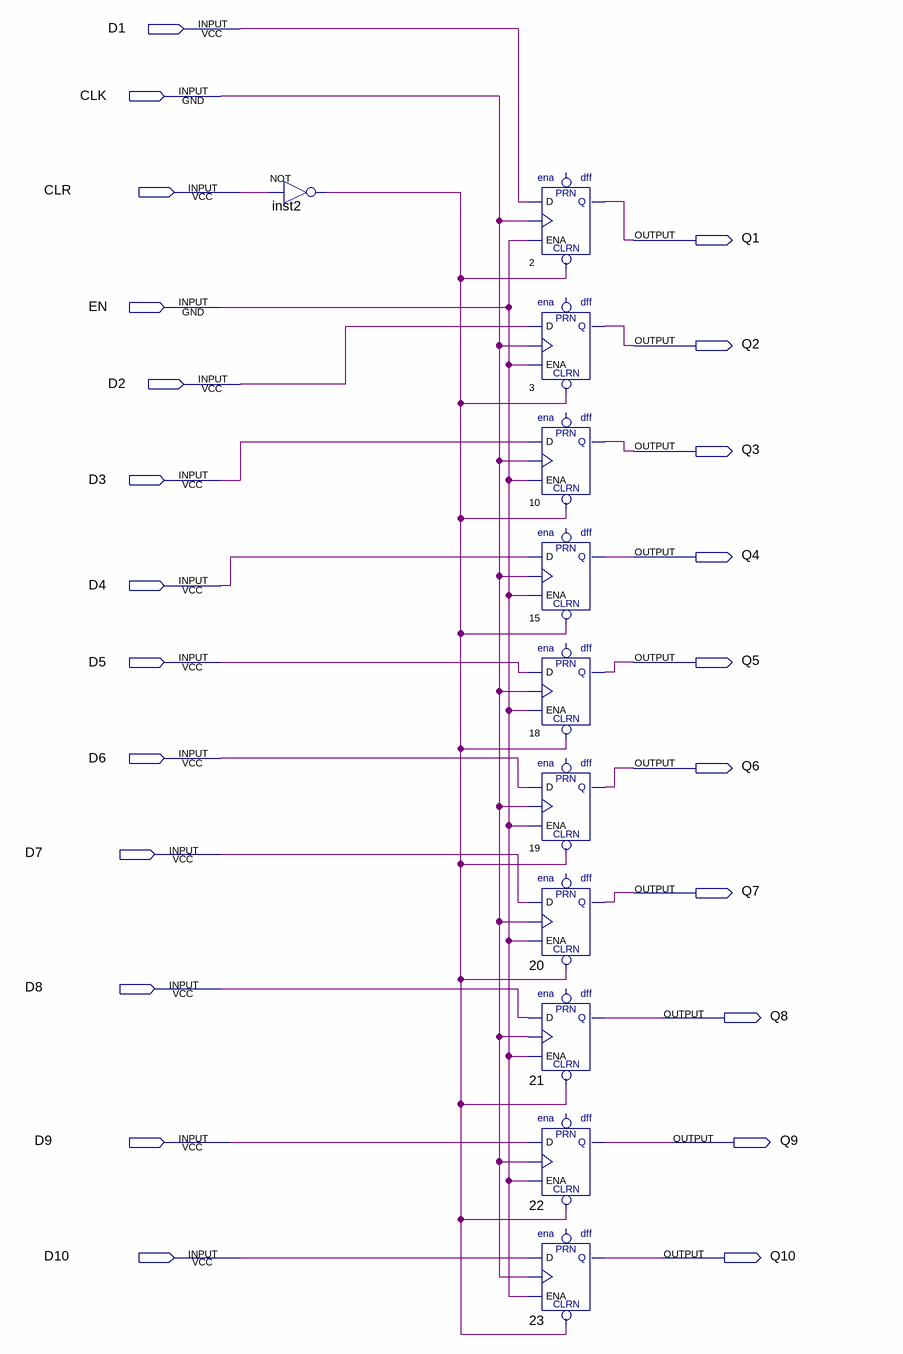
[diagram p0: schematic sheet]
// Quartus schematic 10_Bit_Reg.bdf as structural Verilog: 11 symbols, 23 pins
module \10_Bit_Reg  (
  input  D1,
  input  CLK,
  input  CLR,
  input  EN,
  input  D2,
  input  D3,
  input  D4,
  input  D5,
  input  D6,
  input  D7,
  input  D8,
  input  D9,
  input  D10,
  output Q1,
  output Q2,
  output Q3,
  output Q4,
  output Q5,
  output Q6,
  output Q7,
  output Q8,
  output Q9,
  output Q10
);

  wire inst2_out;

  not inst2 (inst2_out, CLR);
  enadff u_2 (.ENA(EN), .D(D1), .CLRN(inst2_out), .CLK(CLK), .Q(Q1));  // open: PRN
  enadff u_3 (.ENA(EN), .D(D2), .CLRN(inst2_out), .CLK(CLK), .Q(Q2));  // open: PRN
  enadff u_10 (.ENA(EN), .D(D3), .CLRN(inst2_out), .CLK(CLK), .Q(Q3));  // open: PRN
  enadff u_15 (.ENA(EN), .D(D4), .CLRN(inst2_out), .CLK(CLK), .Q(Q4));  // open: PRN
  enadff u_18 (.ENA(EN), .D(D5), .CLRN(inst2_out), .CLK(CLK), .Q(Q5));  // open: PRN
  enadff u_19 (.ENA(EN), .D(D6), .CLRN(inst2_out), .CLK(CLK), .Q(Q6));  // open: PRN
  enadff u_20 (.ENA(EN), .D(D7), .CLRN(inst2_out), .CLK(CLK), .Q(Q7));  // open: PRN
  enadff u_21 (.ENA(EN), .D(D8), .CLRN(inst2_out), .CLK(CLK), .Q(Q8));  // open: PRN
  enadff u_22 (.ENA(EN), .D(D9), .CLRN(inst2_out), .CLK(CLK), .Q(Q9));  // open: PRN
  enadff u_23 (.ENA(EN), .D(D10), .CLRN(inst2_out), .CLK(CLK), .Q(Q10));  // open: PRN
endmodule
